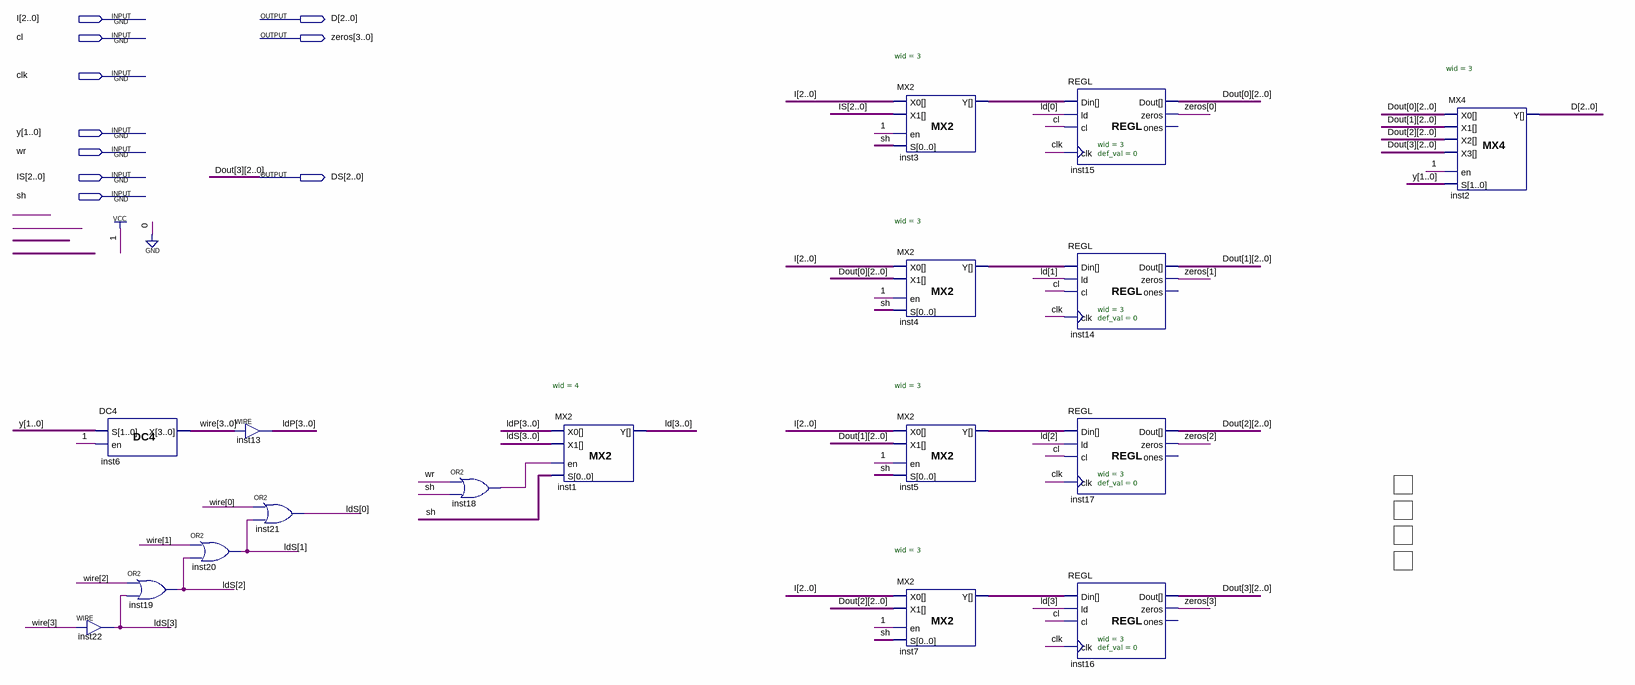
[diagram p0: schematic sheet]
// Quartus schematic tiles4x1.bdf as structural Verilog: 17 symbols, 10 pins
module tiles4x1 (
  input  [2:0] I,
  input  cl,
  input  clk,
  input  [1:0] y,
  input  wr,
  input  [2:0] IS,
  input  sh,
  output [2:0] D,
  output [3:0] zeros,
  output [2:0] DS
);

  wire inst18_out;
  wire [2:0] Dout_0, Dout_1, Dout_2, inst3_y, inst4_y, inst5_y, inst7_y;
  wire [3:0] ld, ldP, ldS, \wire ;

  DC4 inst6 (.S(y), .en(1'b1), .X(\wire ));
  assign ldS[3] = \wire [3];  // WIRE inst22
  or inst19 (ldS[2], \wire [2], ldS[3]);
  or inst20 (ldS[1], \wire [1], ldS[2]);
  assign ldP = \wire ;  // WIRE inst13
  or inst21 (ldS[0], \wire [0], ldS[1]);
  or inst18 (inst18_out, wr, sh);
  MX2 #(.wid(4)) inst1 (.X0(ldP), .X1(ldS), .en(inst18_out), .S(sh), .Y(ld));
  MX2 #(.wid(3)) inst3 (.X0(I), .X1(IS), .en(1'b1), .S(sh), .Y(inst3_y));
  MX2 #(.wid(3)) inst4 (.X0(I), .X1(Dout_0), .en(1'b1), .S(sh), .Y(inst4_y));
  MX2 #(.wid(3)) inst5 (.X0(I), .X1(Dout_1), .en(1'b1), .S(sh), .Y(inst5_y));
  MX2 #(.wid(3)) inst7 (.X0(I), .X1(Dout_2), .en(1'b1), .S(sh), .Y(inst7_y));
  REGL #(.wid(3), .def_val(0)) inst15 (
    .Din(inst3_y), .ld(ld[0]), .cl(cl), .clk(clk), .Dout(Dout_0), .zeros(zeros[0]));  // open: ones
  REGL #(.wid(3), .def_val(0)) inst14 (
    .Din(inst4_y), .ld(ld[1]), .cl(cl), .clk(clk), .Dout(Dout_1), .zeros(zeros[1]));  // open: ones
  REGL #(.wid(3), .def_val(0)) inst17 (
    .Din(inst5_y), .ld(ld[2]), .cl(cl), .clk(clk), .Dout(Dout_2), .zeros(zeros[2]));  // open: ones
  REGL #(.wid(3), .def_val(0)) inst16 (
    .Din(inst7_y), .ld(ld[3]), .cl(cl), .clk(clk), .Dout(DS), .zeros(zeros[3]));  // open: ones
  MX4 #(.wid(3)) inst2 (.X0(Dout_0), .X1(Dout_1), .X2(Dout_2), .X3(DS), .en(1'b1), .S(y), .Y(D));

  // Other names for the same wires on the sheet: Dout_3[2:0] = DS
endmodule
